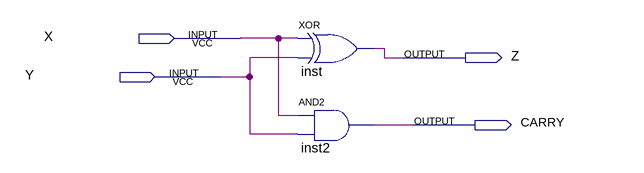
[diagram p0: schematic sheet]
// Quartus schematic Half_adder.bdf as structural Verilog: 2 symbols, 4 pins
module Half_adder (
  input  X,
  input  Y,
  output Z,
  output CARRY
);

  xor inst (Z, X, Y);
  and inst2 (CARRY, X, Y);
endmodule
